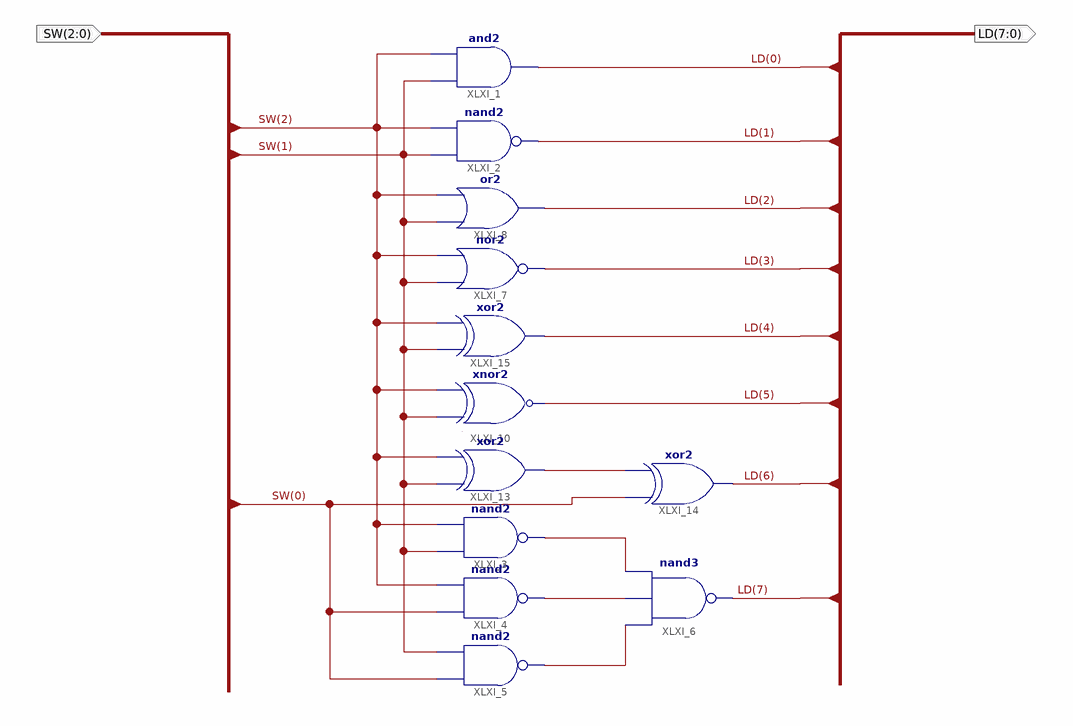
[diagram p0: schematic sheet 1]
// Xilinx ISE schematic gate2.sch (spartan3e) as structural Verilog: 12 symbols, 2 ports
module gate2 (
  input  [2:0] SW,
  output [7:0] LD
);

  wire XLXN_3, XLXN_4, XLXN_5, XLXN_6;

  and XLXI_1 (LD[0], SW[1], SW[2]);
  nand XLXI_2 (LD[1], SW[1], SW[2]);
  nand XLXI_3 (XLXN_4, SW[1], SW[2]);
  nand XLXI_4 (XLXN_5, SW[0], SW[2]);
  nand XLXI_5 (XLXN_6, SW[0], SW[1]);
  nand XLXI_6 (LD[7], XLXN_6, XLXN_5, XLXN_4);
  nor XLXI_7 (LD[3], SW[1], SW[2]);
  or XLXI_8 (LD[2], SW[1], SW[2]);
  xnor XLXI_10 (LD[5], SW[1], SW[2]);
  xor XLXI_13 (XLXN_3, SW[1], SW[2]);
  xor XLXI_14 (LD[6], SW[0], XLXN_3);
  xor XLXI_15 (LD[4], SW[1], SW[2]);
endmodule
